# Altium schematic sheet Sheet_1_2022-06-12-3.schdoc
size 57 x 63 mm
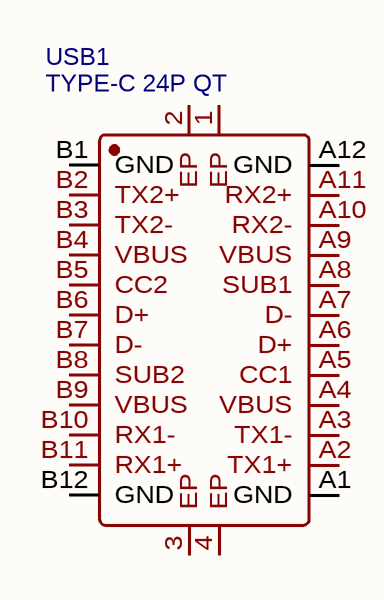
[diagram p0: Sheet_1_2022-06-12-3.schdoc]

## Parts
USB1  TYPE-C 24P QT  [USB-C-SMD_TYPE-C-24P-QT]

## Nets

Not connected (* = marked no-connect by the designer): USB1 1(EP) 2(EP) 3(EP) 4(EP) A1(GND) A2(TX1+) A3(TX1-) A4(VBUS) A5(CC1) A6(D+) A7(D-) A8(SUB1) A9(VBUS) A10(RX2-) A11(RX2+) A12(GND) B1(GND) B2(TX2+) B3(TX2-) B4(VBUS) B5(CC2) B6(D+) B7(D-) B8(SUB2) B9(VBUS) B10(RX1-) B11(RX1+) B12(GND)

## Library data of the parts
USB1 = TYPE-C 24P QT: BOM_Manufacturer: SHOU HAN(首韩); Contributor: LCSC; BOM_Supplier: LCSC; BOM_Supplier Part: C2681555; BOM_Manufacturer Part: TYPE-C 24P QT; BOM_JLCPCB Part Class: Extended Part; spicePre: U; spiceSymbolName: TYPE-C 24P QT